# EAGLE design followLineSensor (EAGLE 7.7.0)
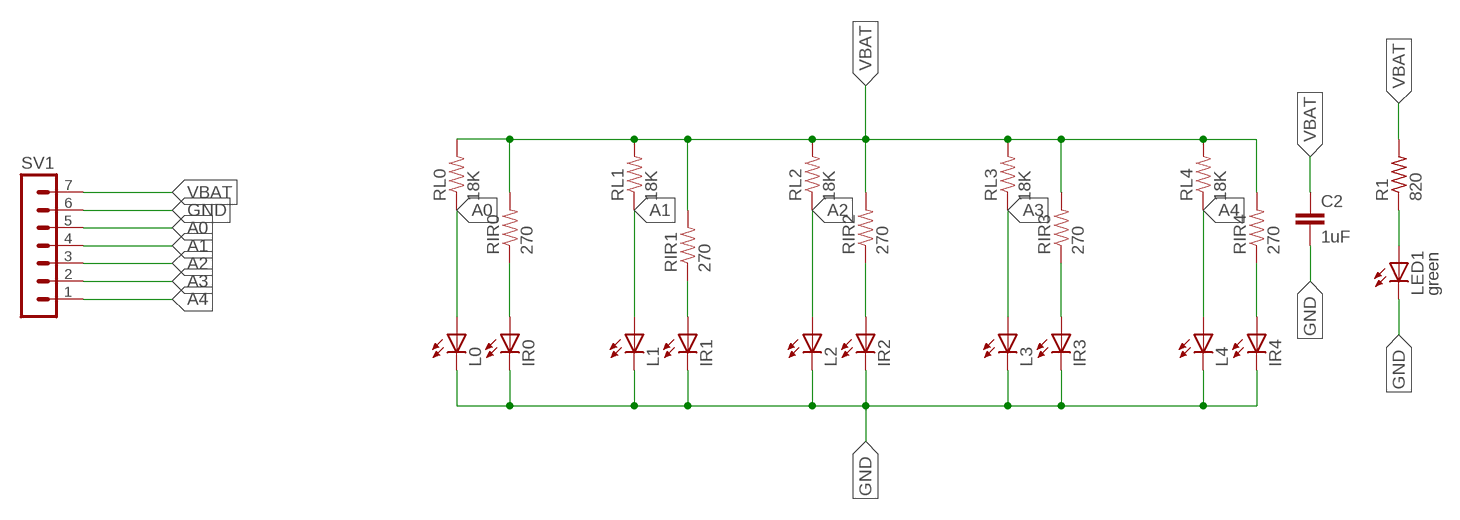
[diagram p0: schematic, sheet 1]

## Parts
C2  1uF  C-EUC1206  [C1206]
IR0  LED5MM  [LED5MM]
IR1  LED5MM  [LED5MM]
IR2  LED5MM  [LED5MM]
IR3  LED5MM  [LED5MM]
IR4  LED5MM  [LED5MM]
L0  LED5MM  [LED5MM]
L1  LED5MM  [LED5MM]
L2  LED5MM  [LED5MM]
L3  LED5MM  [LED5MM]
L4  LED5MM  [LED5MM]
LED1  green  LEDSML0805  [SML0805]
R1  820  R-US_R0805  [R0805]
RIR0  270  RESISTOR1206  [1206]
RIR1  270  RESISTOR1206  [1206]
RIR2  270  RESISTOR1206  [1206]
RIR3  270  RESISTOR1206  [1206]
RIR4  270  RESISTOR1206  [1206]
RL0  18K  RESISTOR1206  [1206]
RL1  18K  RESISTOR1206  [1206]
RL2  18K  RESISTOR1206  [1206]
RL3  18K  RESISTOR1206  [1206]
RL4  18K  RESISTOR1206  [1206]
SV1  MA07-1  [MA07-1]

## Nets
A0: L0.A RL0.1 SV1.5
A1: L1.A RL1.1 SV1.4
A2: L2.A RL2.1 SV1.3
A3: L3.A RL3.1 SV1.2
A4: L4.A RL4.1 SV1.1
GND: C2.2 IR0.K(C) IR1.K(C) IR2.K(C) IR3.K(C) IR4.K(C) L0.K(C) L1.K(C) L2.K(C) L3.K(C) L4.K(C) LED1.C SV1.6
N$2: LED1.A R1.1
N$17: IR4.A RIR4.1
N$18: IR3.A RIR3.1
N$19: IR2.A RIR2.1
N$20: IR1.A RIR1.1
N$21: IR0.A RIR0.1
VBAT: C2.1 R1.2 RIR0.2 RIR1.2 RIR2.2 RIR3.2 RIR4.2 RL0.2 RL1.2 RL2.2 RL3.2 RL4.2 SV1.7

## Library data of the parts
C2 = rcl:C-EU: CAPACITOR, European symbol
IR0 IR1-IR4 L0 L1-L4 LED1 = led:LED: LED OSRAM: - CHIPLED LG R971, LG N971, LY N971, LG Q971, LY Q971, LO R971, LY R971 LH N974, LH R974 LS Q976, LO Q976, LY Q976 LO Q996 - Hyper CHIPLED LW Q18S LB Q993, LB Q99A, LB R99A - SideLED LS A670, LO A670, LY A670, LG A670, LP A670 LB A673, LV A673, LT A673, LW A673 LH A674 LY A675 LS A676, LA A676, LO A676, LY A676, LW A676 LS A679, LY A679, LG A679 - Hyper Micro SIDELED® LS Y876, LA Y876, LO Y876, LY Y876 LT Y87S - SmartLED LW L88C, LW L88S LB L89C, LB L89S, LG L890 LS L89K, LO L89K, LY L89K LS L896, LA L896, LO L896, LY L896 - TOPLED LS T670, LO T670, LY T670, LG T670, LP T670 LSG T670, LSP T670, LSY T670, LOP T670, LYG T670 LG T671, LOG T671, LSG T671 LB T673, LV T673, LT T673, LW T673 LH T674 LS T676, LA T676, LO T676, LY T676, LB T676, LH T676, LSB T676, LW T676 LB T67C, LV T67C, LT T67C, LS T67K, LO T67K, LY T67K, LW E67C LS E67B, LA E67B, LO E67B, LY E67B, LB E67C, LV E67C, LT E67C LW T67C LS T679, LY T679, LG T679 LS T770, LO T770, LY T770, LG T770, LP T770 LB T773, LV T773, LT T773, LW T773 LH T774 LS E675, LA E675, LY E675, LS T675 LS T776, LA T776, LO T776, LY T776, LB T776 LHGB T686 LT T68C, LB T68C - Hyper Mini TOPLED® LB M676 - Mini TOPLED Santana® LG M470 LS M47K, LO M47K, LY M47K Source: http://www.osram.convergy.de LUXEON: - LUMILED® LXK2-PW12-R00, LXK2-PW12-S00, LXK2-PW14-U00, LXK2-PW14-V00 LXK2-PM12-R00, LXK2-PM12-S00, LXK2-PM14-U00 LXK2-PE12-Q00, LXK2-PE12-R00, LXK2-PE12-S00, LXK2-PE14-T00, LXK2-PE14-U00 LXK2-PB12-K00, LXK2-PB12-L00, LXK2-PB12-M00, LXK2-PB14-N00, LXK2-PB14-P00, LXK2-PB14-Q00 LXK2-PR12-L00, LXK2-PR12-M00, LXK2-PR14-Q00, LXK2-PR14-R00 LXK2-PD12-Q00, LXK2-PD12-R00, LXK2-PD12-S00 LXK2-PH12-R00, LXK2-PH12-S00 LXK2-PL12-P00, LXK2-PL12-Q00, LXK2-PL12-R00 Source: www.luxeon.com KINGBRIGHT: KA-3528ASYC Source: www.kingbright.com
R1 = rcl:R-US_: RESISTOR, American symbol
RIR0 RIR1-RIR4 RL0 RL1-RL4 = SparkFun-Passives:RESISTOR: Resistor Basic schematic elements and footprints for 0603, 1206, and PTH resistors.
SV1 = con-lstb:MA07-1: PIN HEADER; OC_FARNELL: unknown; OC_NEWARK: unknown

## Board
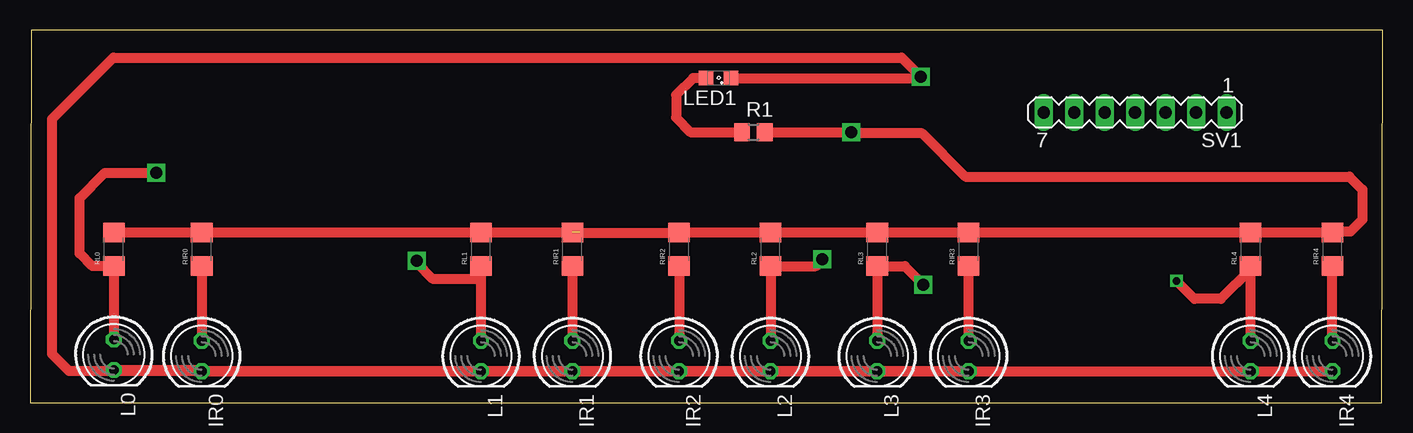
[diagram p1: board, top side]
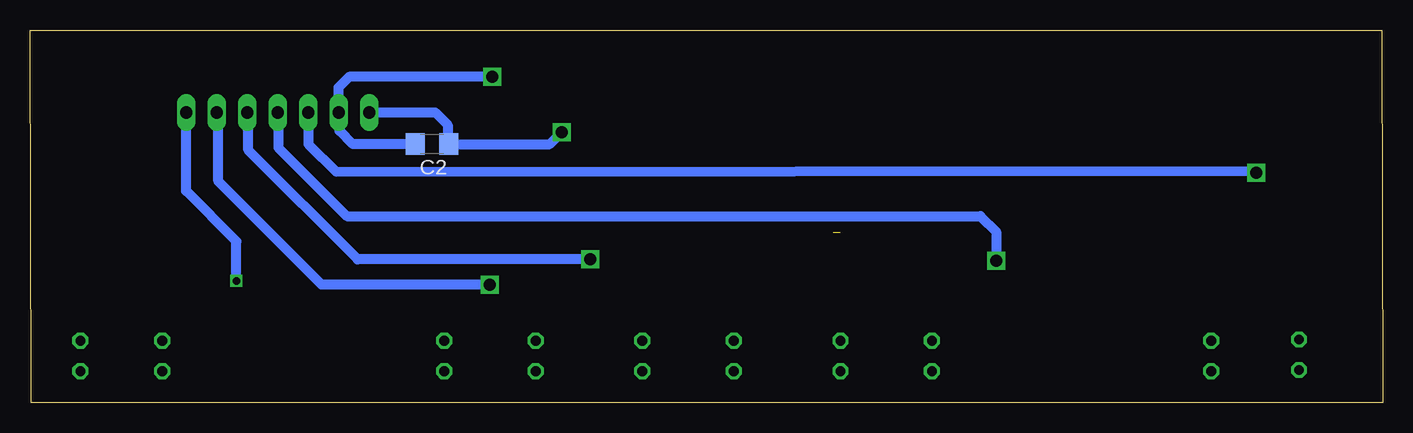
[diagram p2: board, bottom side, seen from below]

Size 112.74 x 31.08 mm. Coordinates in mm from the lower left corner, seen from the top.
Outline: 0,0 112.64,0 112.74,31.08 0.1,31.08 0,0
Copper layers (1*16): Top 0.035mm / dielectric 1.5mm / Bottom 0.035mm
Design rules "default *": minimum track width 0.4mm, minimum drill 24mil, track to track 8mil, track to pad 8mil, pad to pad 8mil, via to via 8mil, smd to smd 8mil, copper to edge 40mil, drill to drill 8mil, minimum pad ring 10mil, minimum via ring 8mil, stop-mask expansion 4mil, vias tented up to drill 0mil, thermal gap 10mil

### Footprints (pad centres in the part's own frame; a part is rotated, then mirrored left to right if it is on the bottom)
C1206 = smd 1.6 x 1.8: 1 -1.4,0; 2 1.4,0
LED5MM = drill 0.813 octagon: A -1.27,0; K 1.27,0
SML0805 = smd 1.2 x 1.2: A 1.05,0; C -1.05,0
R0805 = smd 1.3 x 1.5: 1 -0.95,0; 2 0.95,0
1206 = smd 1.6 x 1.8: 1 -1.4,0; 2 1.4,0
MA07-1 = drill 1.016 long: 1 -7.62,0; 2 -5.08,0; 3 -2.54,0; 4 0,0; 5 2.54,0; 6 5.08,0; 7 7.62,0

### Placement (x,y rotation side)
C2  79.24,21.57 180 bottom
IR0  14.31,3.92 270 top
IR1  45.2,3.92 270 top
IR2  54.09,3.92 270 top
IR3  78.22,3.92 270 top
IR4  108.54,3.92 270 top
L0  6.99,4.02 270 top
L1  37.58,3.92 270 top
L2  61.71,3.92 270 top
L3  70.6,3.92 270 top
L4  101.72,3.92 270 top
LED1  57.38,27.08 180 top
R1  60.28,22.57 0 top
RIR0  14.31,12.81 90 top
RIR1  45.2,12.81 90 top
RIR2  54.09,12.81 90 top
RIR3  78.22,12.81 90 top
RIR4  108.54,12.81 90 top
RL0  6.99,12.81 90 top
RL1  37.58,12.81 90 top
RL2  61.71,12.81 90 top
RL3  70.6,12.81 90 top
RL4  101.72,12.81 90 top
SV1  92.09,24.21 180 top

### Tracks (layer width: path | path; a pad name or v marks a point on that pad's centre or on a via)
A0  (via drill 1)
  Top 0.813: L0.A RL0.1 5.2,11.41 4.14,12.47 4.14,17.07 6.24,19.17 v10.54,19.17
  Bottom 0.813: SV1.5 89.55,21.58 87.24,19.27 10.74,19.37 v10.54,19.17
A1  (via drill 1)
  Top 0.813: RL1.1 37.58,10.67 | 37.58,10.67 L1.A | v32.24,11.87 32.24,11.67 33.54,10.37 37.28,10.37 37.58,10.67
  Bottom 0.406: 92.04,24.16 SV1.4
  Bottom 0.813: 92.04,24.16 92.04,21.27 86.34,15.57 33.54,15.57 32.24,14.27 v32.24,11.87
A2  (via drill 1)
  Top 0.813: L2.A RL2.1 65.48,11.41 v66.04,11.97
  Bottom 0.406: 94.74,24.1 SV1.3
  Bottom 0.813: v66.04,11.97 85.44,11.97 94.54,21.07 94.54,24.12 SV1.3
A3  (via drill 1)
  Top 0.813: L3.A RL3.1 72.9,11.41 v74.44,9.87
  Bottom 0.406: 97.24,24.14 SV1.2
  Bottom 0.813: v74.44,9.87 88.44,9.87 97.04,18.47 97.04,24.08 SV1.2
A4  (via drill 0.6)
  Top 0.813: L4.A RL4.1 101.72,11.15 99.24,8.67 97.04,8.67 v95.54,10.17
  Bottom 0.813: v95.54,10.17 95.54,13.47 99.74,17.67 99.74,24.18 SV1.1
GND  (via drill 1)
  Top 0.406: LED1.C 58.45,27.08
  Top 0.813: IR3.K L3.K L2.K IR2.K IR1.K L1.K IR0.K 14.21,2.75 L0.K | IR3.K L4.K IR4.K | LED1.C 74.15,27.08 v74.24,27.17 72.64,28.77 6.94,28.77 1.84,23.67 1.84,4.07 3.26,2.65 IR3.K
  Bottom 0.813: C2.2 85.84,21.57 86.94,22.67 86.94,24.14 SV1.6 87.04,24.24 87.04,26.27 86.14,27.17 v74.24,27.17
N$2
  Top 0.813: LED1.A 55.25,27.08 53.84,25.67 53.84,23.77 55.04,22.57 R1.1
N$17
  Top 0.813: IR4.A RIR4.1
N$18
  Top 0.813: IR3.A RIR3.1
N$19
  Top 0.813: RIR2.1 IR2.A
N$20
  Top 0.813: RIR1.1 IR1.A
N$21
  Top 0.813: RIR0.1 IR0.A
VBAT  (via drill 1)  (1 unrouted)
  Top 0.813: R1.2 v68.44,22.57 68.54,22.47 74.34,22.47 77.94,18.87 109.94,18.87 111.04,17.77 111.04,15.27 110.04,14.27 108.6,14.27 RIR4.2 RL4.2 RIR3.2 RL3.2 RL2.2 RIR2.2 54.05,14.17 45.84,14.17 45.8,14.21 RL1.2 RIR0.2 RL0.2
  Bottom 0.406: 84.44,24.24 SV1.7
  Bottom 0.813: SV1.7 78.98,24.21 77.94,23.17 77.94,21.67 C2.1 69.44,21.57 v68.44,22.57